# Altium project DIO_RJ45_DIOT.PrjPCB (part 3 of 3)
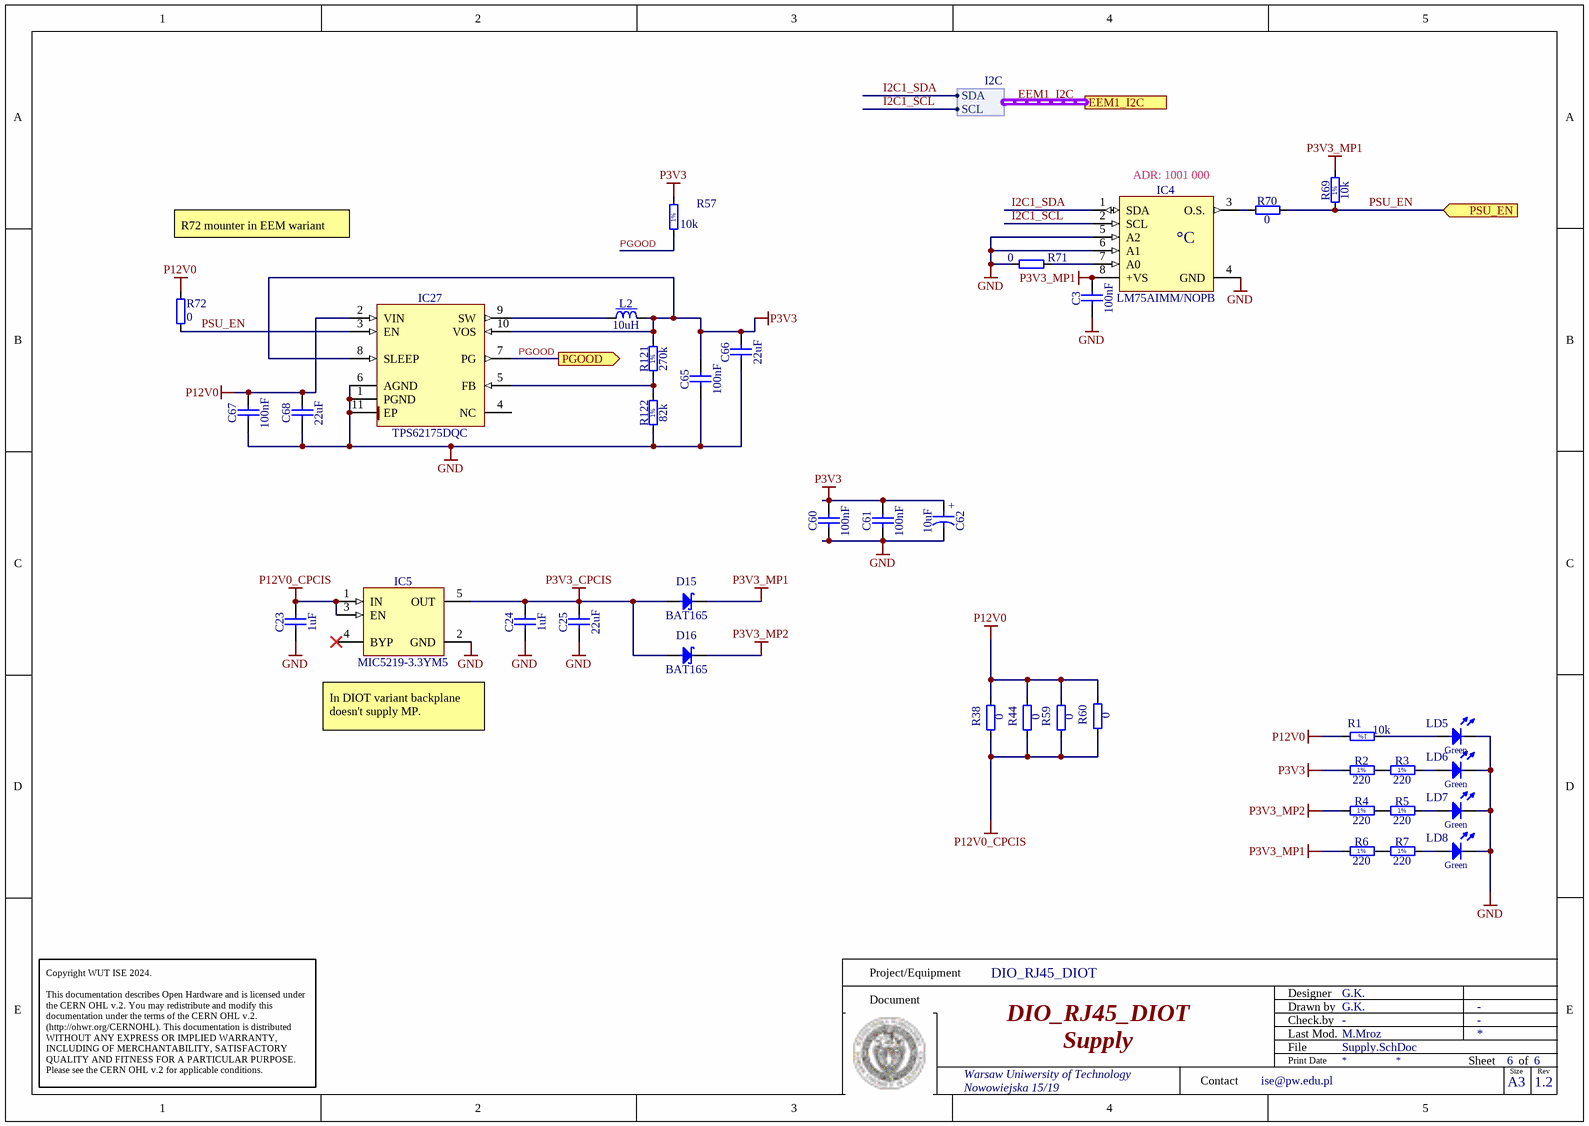
[diagram p6: Supply.SchDoc]

## Nets that join several sheets
GND: DIO45_TOP (C1.2 R8.2 R62.2), CPCIS_Connectors (63 pins), EEM_Connectors (20 pins), Input (46 pins), U_Input/U_LVDS_repeater (6 pins), U_Input/U_LVDS_repeater (6 pins), U_Input/U_LVDS_repeater (6 pins), U_Input/U_LVDS_repeater (6 pins), U_Input/U_LVDS_repeater (6 pins), U_Input/U_LVDS_repeater (6 pins), U_Input/U_LVDS_repeater (6 pins), U_Input/U_LVDS_repeater (6 pins), U_Input/U_LVDS_repeater (6 pins), U_Input/U_LVDS_repeater (6 pins), U_Input/U_LVDS_repeater (6 pins), U_Input/U_LVDS_repeater (6 pins), U_Input/U_LVDS_repeater (6 pins), U_Input/U_LVDS_repeater (6 pins), U_Input/U_LVDS_repeater (6 pins), U_Input/U_LVDS_repeater (6 pins), Supply (24 pins)
P3V3: Input (41 pins), U_Input/U_LVDS_repeater (5 pins), U_Input/U_LVDS_repeater (5 pins), U_Input/U_LVDS_repeater (5 pins), U_Input/U_LVDS_repeater (5 pins), U_Input/U_LVDS_repeater (5 pins), U_Input/U_LVDS_repeater (5 pins), U_Input/U_LVDS_repeater (5 pins), U_Input/U_LVDS_repeater (5 pins), U_Input/U_LVDS_repeater (5 pins), U_Input/U_LVDS_repeater (5 pins), U_Input/U_LVDS_repeater (5 pins), U_Input/U_LVDS_repeater (5 pins), U_Input/U_LVDS_repeater (5 pins), U_Input/U_LVDS_repeater (5 pins), U_Input/U_LVDS_repeater (5 pins), U_Input/U_LVDS_repeater (5 pins), Supply (11 pins)
P3V3_CPCIS: CPCIS_Connectors (12 pins), EEM_Connectors (C4.2 IC1.14), Supply (5 pins)
P3V3_MP1: EEM_Connectors (J14.30), Input (8 pins), Supply (5 pins)
P3V3_MP2: EEM_Connectors (J24.30), Input (9 pins), Supply (D16.1 R4.1)
P12V0: EEM_Connectors (J14.28 J14.29 J24.28 J24.29), Input (B11.1), Supply (9 pins)
P12V0_CPCIS: CPCIS_Connectors (7 pins), Supply (7 pins)
BP_I2C.SCL: CPCIS_Connectors (D11.3 J1.B2), EEM_Connectors (IC1.8 IC1.11)
BP_I2C.SDA: CPCIS_Connectors (D11.1 J1.C2), EEM_Connectors (IC1.1 IC1.4)
BP_IO.BP_LVDS0_N: CPCIS_Connectors (J1.E3), EEM_Connectors (R65.1)
BP_IO.BP_LVDS0_P: CPCIS_Connectors (J1.D3), EEM_Connectors (R64.1)
BP_IO.BP_LVDS1_N: CPCIS_Connectors (J1.B3), EEM_Connectors (R67.1)
BP_IO.BP_LVDS1_P: CPCIS_Connectors (J1.A3), EEM_Connectors (R66.1)
BP_IO.BP_LVDS2_N: CPCIS_Connectors (J1.C4), EEM_Connectors (R11.1)
BP_IO.BP_LVDS2_P: CPCIS_Connectors (J1.B4), EEM_Connectors (R10.1)
BP_IO.BP_LVDS3_N: CPCIS_Connectors (J1.L4), EEM_Connectors (R13.1)
BP_IO.BP_LVDS3_P: CPCIS_Connectors (J1.K4), EEM_Connectors (R12.1)
BP_IO.BP_LVDS4_N: CPCIS_Connectors (J1.I4), EEM_Connectors (R15.1)
BP_IO.BP_LVDS4_P: CPCIS_Connectors (J1.H4), EEM_Connectors (R14.1)
BP_IO.BP_LVDS5_N: CPCIS_Connectors (J1.K5), EEM_Connectors (R17.1)
BP_IO.BP_LVDS5_P: CPCIS_Connectors (J1.J5), EEM_Connectors (R16.1)
BP_IO.BP_LVDS6_N: CPCIS_Connectors (J1.H5), EEM_Connectors (R19.1)
BP_IO.BP_LVDS6_P: CPCIS_Connectors (J1.G5), EEM_Connectors (R18.1)
BP_IO.BP_LVDS7_N: CPCIS_Connectors (J1.F6), EEM_Connectors (R21.1)
BP_IO.BP_LVDS7_P: CPCIS_Connectors (J1.E6), EEM_Connectors (R20.1)
BP_IO.BP_LVDS8_N: CPCIS_Connectors (J1.C6), EEM_Connectors (R23.1)
BP_IO.BP_LVDS8_P: CPCIS_Connectors (J1.B6), EEM_Connectors (R22.1)
BP_IO.BP_LVDS9_N: CPCIS_Connectors (J1.L6), EEM_Connectors (R25.1)
BP_IO.BP_LVDS9_P: CPCIS_Connectors (J1.K6), EEM_Connectors (R24.1)
BP_IO.BP_LVDS10_N: CPCIS_Connectors (J1.I6), EEM_Connectors (R27.1)
BP_IO.BP_LVDS10_P: CPCIS_Connectors (J1.H6), EEM_Connectors (R26.1)
BP_IO.BP_LVDS11_N: CPCIS_Connectors (J2.E1), EEM_Connectors (R29.1)
BP_IO.BP_LVDS11_P: CPCIS_Connectors (J2.D1), EEM_Connectors (R28.1)
BP_IO.BP_LVDS12_N: CPCIS_Connectors (J2.B1), EEM_Connectors (R31.1)
BP_IO.BP_LVDS12_P: CPCIS_Connectors (J2.A1), EEM_Connectors (R30.1)
BP_IO.BP_LVDS13_N: CPCIS_Connectors (J2.K1), EEM_Connectors (R33.1)
BP_IO.BP_LVDS13_P: CPCIS_Connectors (J2.J1), EEM_Connectors (R32.1)
BP_IO.BP_LVDS14_N: CPCIS_Connectors (J2.H1), EEM_Connectors (R35.1)
BP_IO.BP_LVDS14_P: CPCIS_Connectors (J2.G1), EEM_Connectors (R34.1)
BP_IO.BP_LVDS15_N: CPCIS_Connectors (J1.F2), EEM_Connectors (R37.1)
BP_IO.BP_LVDS15_P: CPCIS_Connectors (J1.E2), EEM_Connectors (R36.1)
DIR_CTRL0: Input (IC23.4 R90.1 R97.2 SW5.1), U_Input/U_LVDS_repeater (IC19P.3 T25P.1)
DIR_CTRL1: Input (IC23.5 R92.1 R99.2 SW5.2), U_Input/U_LVDS_repeater (IC19O.3 T25O.1)
DIR_CTRL2: Input (IC23.6 R94.1 R101.2 SW5.3), U_Input/U_LVDS_repeater (IC19N.3 T25N.1)
DIR_CTRL3: Input (IC23.7 R96.1 R103.2 SW5.4), U_Input/U_LVDS_repeater (IC19M.3 T25M.1)
DIR_CTRL4: Input (IC23.9 R89.2 R98.1 SW5.5), U_Input/U_LVDS_repeater (IC19L.3 T25L.1)
DIR_CTRL5: Input (IC23.10 R91.2 R100.1 SW5.6), U_Input/U_LVDS_repeater (IC19K.3 T25K.1)
DIR_CTRL6: Input (IC23.11 R93.2 R102.1 SW5.7), U_Input/U_LVDS_repeater (IC19J.3 T25J.1)
DIR_CTRL7: Input (IC23.12 R95.2 R104.1 SW5.8), U_Input/U_LVDS_repeater (IC19I.3 T25I.1)
DIR_CTRL8: Input (IC25.4 R106.1 R113.2 SW6.1), U_Input/U_LVDS_repeater (IC19H.3 T25H.1)
DIR_CTRL9: Input (IC25.5 R108.1 R115.2 SW6.2), U_Input/U_LVDS_repeater (IC19G.3 T25G.1)
DIR_CTRL10: Input (IC25.6 R110.1 R117.2 SW6.3), U_Input/U_LVDS_repeater (IC19F.3 T25F.1)
DIR_CTRL11: Input (IC25.7 R112.1 R119.2 SW6.4), U_Input/U_LVDS_repeater (IC19E.3 T25E.1)
DIR_CTRL12: Input (IC25.9 R105.2 R114.1 SW6.5), U_Input/U_LVDS_repeater (IC19D.3 T25D.1)
DIR_CTRL13: Input (IC25.10 R107.2 R116.1 SW6.6), U_Input/U_LVDS_repeater (IC19C.3 T25C.1)
DIR_CTRL14: Input (IC25.11 R109.2 R118.1 SW6.7), U_Input/U_LVDS_repeater (IC19B.3 T25B.1)
DIR_CTRL15: Input (IC25.12 R111.2 R120.1 SW6.8), U_Input/U_LVDS_repeater (IC19A.3 T25A.1)
EEM1_I2C.SCL: EEM_Connectors (IC1.9 IC1.10 J14.27), Input (B2.1 D9.6 IC23.14 IC24.6), Supply (IC4.2)
EEM1_I2C.SDA: EEM_Connectors (IC1.2 IC1.3 J14.26), Input (B6.1 D9.1 IC23.15 IC24.5), Supply (IC4.1)
EEM2_I2C.SCL: EEM_Connectors (J24.27), Input (B4.1 D10.6 IC25.14 IC26.6)
EEM2_I2C.SDA: EEM_Connectors (J24.26), Input (B3.1 D10.1 IC25.15 IC26.5)
LVDS0_N: EEM_Connectors (J14.3 R65.2), U_Input/U_LVDS_repeater (IC19P.1 IC20P.5 R132P.2)
LVDS0_P: EEM_Connectors (J14.2 R64.2), U_Input/U_LVDS_repeater (IC19P.8 IC20P.6 R132P.1)
LVDS1_N: EEM_Connectors (J14.6 R67.2), U_Input/U_LVDS_repeater (IC19O.1 IC20O.5 R132O.2)
LVDS1_P: EEM_Connectors (J14.5 R66.2), U_Input/U_LVDS_repeater (IC19O.8 IC20O.6 R132O.1)
LVDS2_N: EEM_Connectors (J14.9 R11.2), U_Input/U_LVDS_repeater (IC19N.1 IC20N.5 R132N.2)
LVDS2_P: EEM_Connectors (J14.8 R10.2), U_Input/U_LVDS_repeater (IC19N.8 IC20N.6 R132N.1)
LVDS3_N: EEM_Connectors (J14.12 R13.2), U_Input/U_LVDS_repeater (IC19M.1 IC20M.5 R132M.2)
LVDS3_P: EEM_Connectors (J14.11 R12.2), U_Input/U_LVDS_repeater (IC19M.8 IC20M.6 R132M.1)
LVDS4_N: EEM_Connectors (J14.15 R15.2), U_Input/U_LVDS_repeater (IC19L.1 IC20L.5 R132L.2)
LVDS4_P: EEM_Connectors (J14.14 R14.2), U_Input/U_LVDS_repeater (IC19L.8 IC20L.6 R132L.1)
LVDS5_N: EEM_Connectors (J14.18 R17.2), U_Input/U_LVDS_repeater (IC19K.1 IC20K.5 R132K.2)
LVDS5_P: EEM_Connectors (J14.17 R16.2), U_Input/U_LVDS_repeater (IC19K.8 IC20K.6 R132K.1)
LVDS6_N: EEM_Connectors (J14.21 R19.2), U_Input/U_LVDS_repeater (IC19J.1 IC20J.5 R132J.2)
LVDS6_P: EEM_Connectors (J14.20 R18.2), U_Input/U_LVDS_repeater (IC19J.8 IC20J.6 R132J.1)
LVDS7_N: EEM_Connectors (J14.24 R21.2), U_Input/U_LVDS_repeater (IC19I.1 IC20I.5 R132I.2)
LVDS7_P: EEM_Connectors (J14.23 R20.2), U_Input/U_LVDS_repeater (IC19I.8 IC20I.6 R132I.1)
LVDS8_N: EEM_Connectors (J24.3 R23.2), U_Input/U_LVDS_repeater (IC19H.1 IC20H.5 R132H.2)
LVDS8_P: EEM_Connectors (J24.2 R22.2), U_Input/U_LVDS_repeater (IC19H.8 IC20H.6 R132H.1)
LVDS9_N: EEM_Connectors (J24.6 R25.2), U_Input/U_LVDS_repeater (IC19G.1 IC20G.5 R132G.2)
LVDS9_P: EEM_Connectors (J24.5 R24.2), U_Input/U_LVDS_repeater (IC19G.8 IC20G.6 R132G.1)
LVDS10_N: EEM_Connectors (J24.9 R27.2), U_Input/U_LVDS_repeater (IC19F.1 IC20F.5 R132F.2)
LVDS10_P: EEM_Connectors (J24.8 R26.2), U_Input/U_LVDS_repeater (IC19F.8 IC20F.6 R132F.1)
LVDS11_N: EEM_Connectors (J24.12 R29.2), U_Input/U_LVDS_repeater (IC19E.1 IC20E.5 R132E.2)
LVDS11_P: EEM_Connectors (J24.11 R28.2), U_Input/U_LVDS_repeater (IC19E.8 IC20E.6 R132E.1)
LVDS12_N: EEM_Connectors (J24.15 R31.2), U_Input/U_LVDS_repeater (IC19D.1 IC20D.5 R132D.2)
LVDS12_P: EEM_Connectors (J24.14 R30.2), U_Input/U_LVDS_repeater (IC19D.8 IC20D.6 R132D.1)
LVDS13_N: EEM_Connectors (J24.18 R33.2), U_Input/U_LVDS_repeater (IC19C.1 IC20C.5 R132C.2)
LVDS13_P: EEM_Connectors (J24.17 R32.2), U_Input/U_LVDS_repeater (IC19C.8 IC20C.6 R132C.1)
LVDS14_N: EEM_Connectors (J24.21 R35.2), U_Input/U_LVDS_repeater (IC19B.1 IC20B.5 R132B.2)
LVDS14_P: EEM_Connectors (J24.20 R34.2), U_Input/U_LVDS_repeater (IC19B.8 IC20B.6 R132B.1)
LVDS15_N: EEM_Connectors (J24.24 R37.2), U_Input/U_LVDS_repeater (IC19A.1 IC20A.5 R132A.2)
LVDS15_P: EEM_Connectors (J24.23 R36.2), U_Input/U_LVDS_repeater (IC19A.8 IC20A.6 R132A.1)
LVDS_IOA_N: Input (D7.3 J15.2A), U_Input/U_LVDS_repeater (IC19D.5 IC20D.1 R131D.1)
LVDS_IOA_N: Input (D8.3 J15.5A), U_Input/U_LVDS_repeater (IC19C.5 IC20C.1 R131C.1)
LVDS_IOA_N: Input (D7.4 J15.6A), U_Input/U_LVDS_repeater (IC19B.5 IC20B.1 R131B.1)
LVDS_IOA_N: Input (D8.4 J15.8A), U_Input/U_LVDS_repeater (IC19A.5 IC20A.1 R131A.1)
LVDS_IOA_N: Input (D1.3 J15.2D), U_Input/U_LVDS_repeater (IC19P.5 IC20P.1 R131P.1)
LVDS_IOA_N: Input (D2.3 J15.5D), U_Input/U_LVDS_repeater (IC19O.5 IC20O.1 R131O.1)
LVDS_IOA_N: Input (D1.4 J15.6D), U_Input/U_LVDS_repeater (IC19N.5 IC20N.1 R131N.1)
LVDS_IOA_N: Input (D2.4 J15.8D), U_Input/U_LVDS_repeater (IC19M.5 IC20M.1 R131M.1)
LVDS_IOA_N: Input (D5.3 J15.2B), U_Input/U_LVDS_repeater (IC19H.5 IC20H.1 R131H.1)
LVDS_IOA_N: Input (D6.3 J15.5B), U_Input/U_LVDS_repeater (IC19G.5 IC20G.1 R131G.1)
LVDS_IOA_N: Input (D5.4 J15.6B), U_Input/U_LVDS_repeater (IC19F.5 IC20F.1 R131F.1)
LVDS_IOA_N: Input (D6.4 J15.8B), U_Input/U_LVDS_repeater (IC19E.5 IC20E.1 R131E.1)
LVDS_IOA_N: Input (D3.1 J15.2C), U_Input/U_LVDS_repeater (IC19L.5 IC20L.1 R131L.1)
LVDS_IOA_N: Input (D4.1 J15.5C), U_Input/U_LVDS_repeater (IC19K.5 IC20K.1 R131K.1)
LVDS_IOA_N: Input (D3.4 J15.6C), U_Input/U_LVDS_repeater (IC19J.5 IC20J.1 R131J.1)
LVDS_IOA_N: Input (D4.4 J15.8C), U_Input/U_LVDS_repeater (IC19I.5 IC20I.1 R131I.1)
LVDS_IOA_P: Input (D7.1 J15.1A), U_Input/U_LVDS_repeater (IC19D.6 IC20D.8 R131D.2)
LVDS_IOA_P: Input (D7.6 J15.3A), U_Input/U_LVDS_repeater (IC19B.6 IC20B.8 R131B.2)
LVDS_IOA_P: Input (D8.1 J15.4A), U_Input/U_LVDS_repeater (IC19C.6 IC20C.8 R131C.2)
LVDS_IOA_P: Input (D8.6 J15.7A), U_Input/U_LVDS_repeater (IC19A.6 IC20A.8 R131A.2)
LVDS_IOA_P: Input (D1.1 J15.1D), U_Input/U_LVDS_repeater (IC19P.6 IC20P.8 R131P.2)
LVDS_IOA_P: Input (D1.6 J15.3D), U_Input/U_LVDS_repeater (IC19N.6 IC20N.8 R131N.2)
LVDS_IOA_P: Input (D2.1 J15.4D), U_Input/U_LVDS_repeater (IC19O.6 IC20O.8 R131O.2)
LVDS_IOA_P: Input (D2.6 J15.7D), U_Input/U_LVDS_repeater (IC19M.6 IC20M.8 R131M.2)
LVDS_IOA_P: Input (D5.1 J15.1B), U_Input/U_LVDS_repeater (IC19H.6 IC20H.8 R131H.2)
LVDS_IOA_P: Input (D5.6 J15.3B), U_Input/U_LVDS_repeater (IC19F.6 IC20F.8 R131F.2)
LVDS_IOA_P: Input (D6.1 J15.4B), U_Input/U_LVDS_repeater (IC19G.6 IC20G.8 R131G.2)
LVDS_IOA_P: Input (D6.6 J15.7B), U_Input/U_LVDS_repeater (IC19E.6 IC20E.8 R131E.2)
LVDS_IOA_P: Input (D3.3 J15.1C), U_Input/U_LVDS_repeater (IC19L.6 IC20L.8 R131L.2)
LVDS_IOA_P: Input (D3.6 J15.3C), U_Input/U_LVDS_repeater (IC19J.6 IC20J.8 R131J.2)
LVDS_IOA_P: Input (D4.3 J15.4C), U_Input/U_LVDS_repeater (IC19K.6 IC20K.8 R131K.2)
LVDS_IOA_P: Input (D4.6 J15.7C), U_Input/U_LVDS_repeater (IC19I.6 IC20I.8 R131I.2)
PGOOD: CPCIS_Connectors (T1.1), Supply (IC27.7 R57.1)
PSU_EN: CPCIS_Connectors (R53.1), Supply (IC27.3 R69.1 R70.2 R72.1)
SERVMOD_3V3: CPCIS_Connectors (R43.1 R45.2), EEM_Connectors (IC1.5 IC1.6 IC1.12 IC1.13)

## Assembly variants
EEM: not fitted C4 C5 C7 C8 C9 C10 C23 C24 C25 D11 D12 D13 D14 D15 D16 IC1 IC2 IC3 IC5 J1 J2 R10 R11 R12 R13 R14 R15 R16 R17 R18 R19 R20 R21 R22 R23 R24 R25 R26 R27 R28 R29 R30 R31 R32 R33 R34 R35 R36 R37 R38 R39 R40 R41 R42 R43 R44 R45 R46 R47 R48 R49 R50 R51 R52 R53 R54 R55 R56 R58 R59 R60 R61 R64 R65 R66 R67 T1 T2 T3 T4
DIOT: not fitted J14 J24 R68 R72